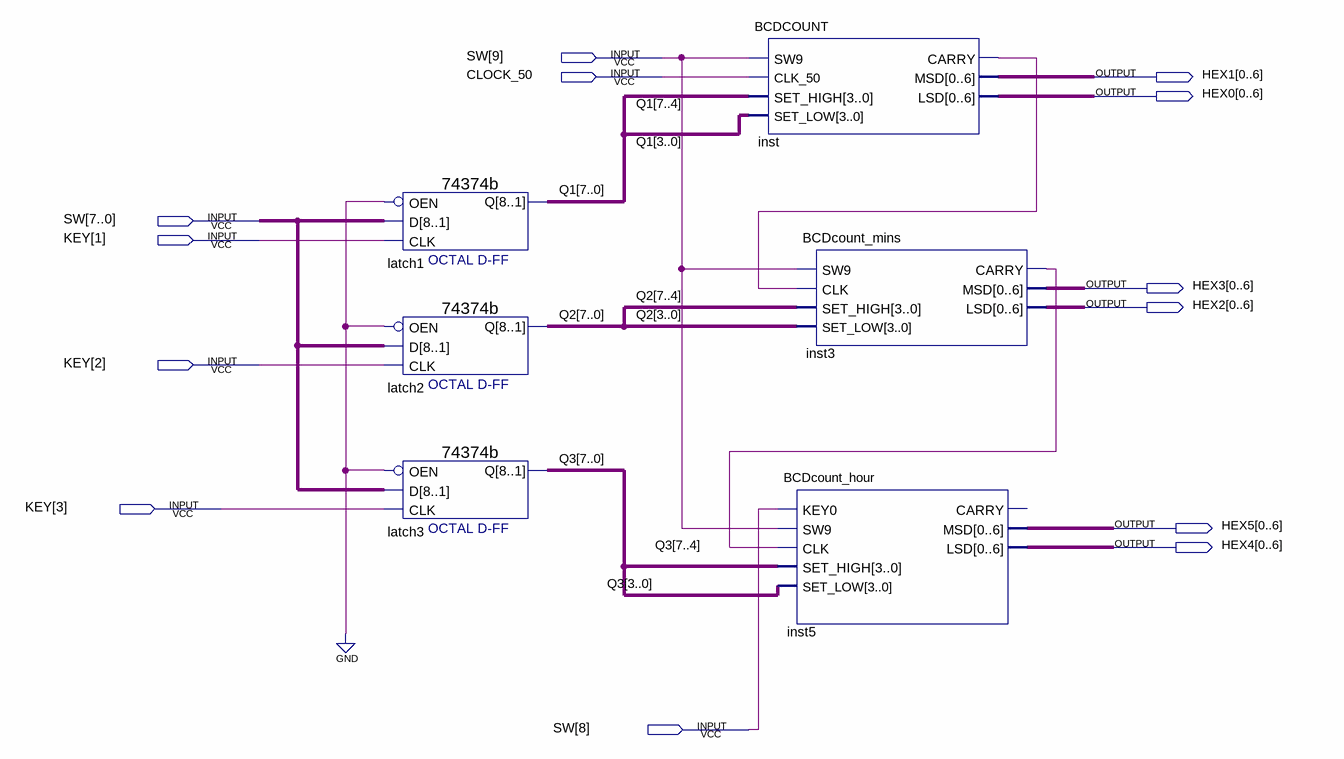
[diagram p0: schematic sheet]
// Quartus schematic 12HourClock.bdf as structural Verilog: 6 symbols, 13 pins
module \12HourClock  (
  input  [9:0] SW,
  input  CLOCK_50,
  input  [3:1] KEY,
  output [0:6] HEX1,
  output [0:6] HEX0,
  output [0:6] HEX3,
  output [0:6] HEX2,
  output [0:6] HEX5,
  output [0:6] HEX4
);

  wire inst3_carry, inst_carry;
  wire [7:0] Q1, Q2, Q3;

  \74374b  latch1 (.D(SW[7:0]), .OEN(1'b0), .CLK(KEY[1]), .Q(Q1));
  \74374b  latch2 (.D(SW[7:0]), .OEN(1'b0), .CLK(KEY[2]), .Q(Q2));
  \74374b  latch3 (.D(SW[7:0]), .OEN(1'b0), .CLK(KEY[3]), .Q(Q3));
  BCDCOUNT inst (
    .SW9(SW[9]), .CLK_50(CLOCK_50), .SET_HIGH(Q1[7:4]), .SET_LOW(Q1[3:0]), .CARRY(inst_carry), .MSD(HEX1),
    .LSD(HEX0));
  BCDcount_mins inst3 (
    .SW9(SW[9]), .CLK(inst_carry), .SET_HIGH(Q2[7:4]), .SET_LOW(Q2[3:0]), .CARRY(inst3_carry), .MSD(HEX3),
    .LSD(HEX2));
  BCDcount_hour inst5 (
    .KEY0(SW[8]), .SW9(SW[9]), .CLK(inst3_carry), .SET_HIGH(Q3[7:4]), .SET_LOW(Q3[3:0]), .MSD(HEX5),
    .LSD(HEX4));  // open: CARRY
endmodule
